# Altium schematic sheet Power_BE.SchDoc: PDN - Backend
size A4; Date: 06.10.2023; ApprovedBy: M.Sc. Tobias Wirth; CheckedBy: M.Sc. Tobias Wirth; Author: M.Sc. Tobias Wirth; CompanyName: University of Stuttgart; DrawnBy: M.Sc. Tobias Wirth; Engineer: M.Sc. Tobias Wirth; Organization: IIS; Address1: Pfaffenwaldring 47; Address2: 70569 Stuttgart; Revision: V1.2; SheetNumber: 16; SheetTotal: 17; ProjectNameAlt: AUS - NMR System; Time: 17:30; ImagePath: N/A; Application_BuildNumber: N/A
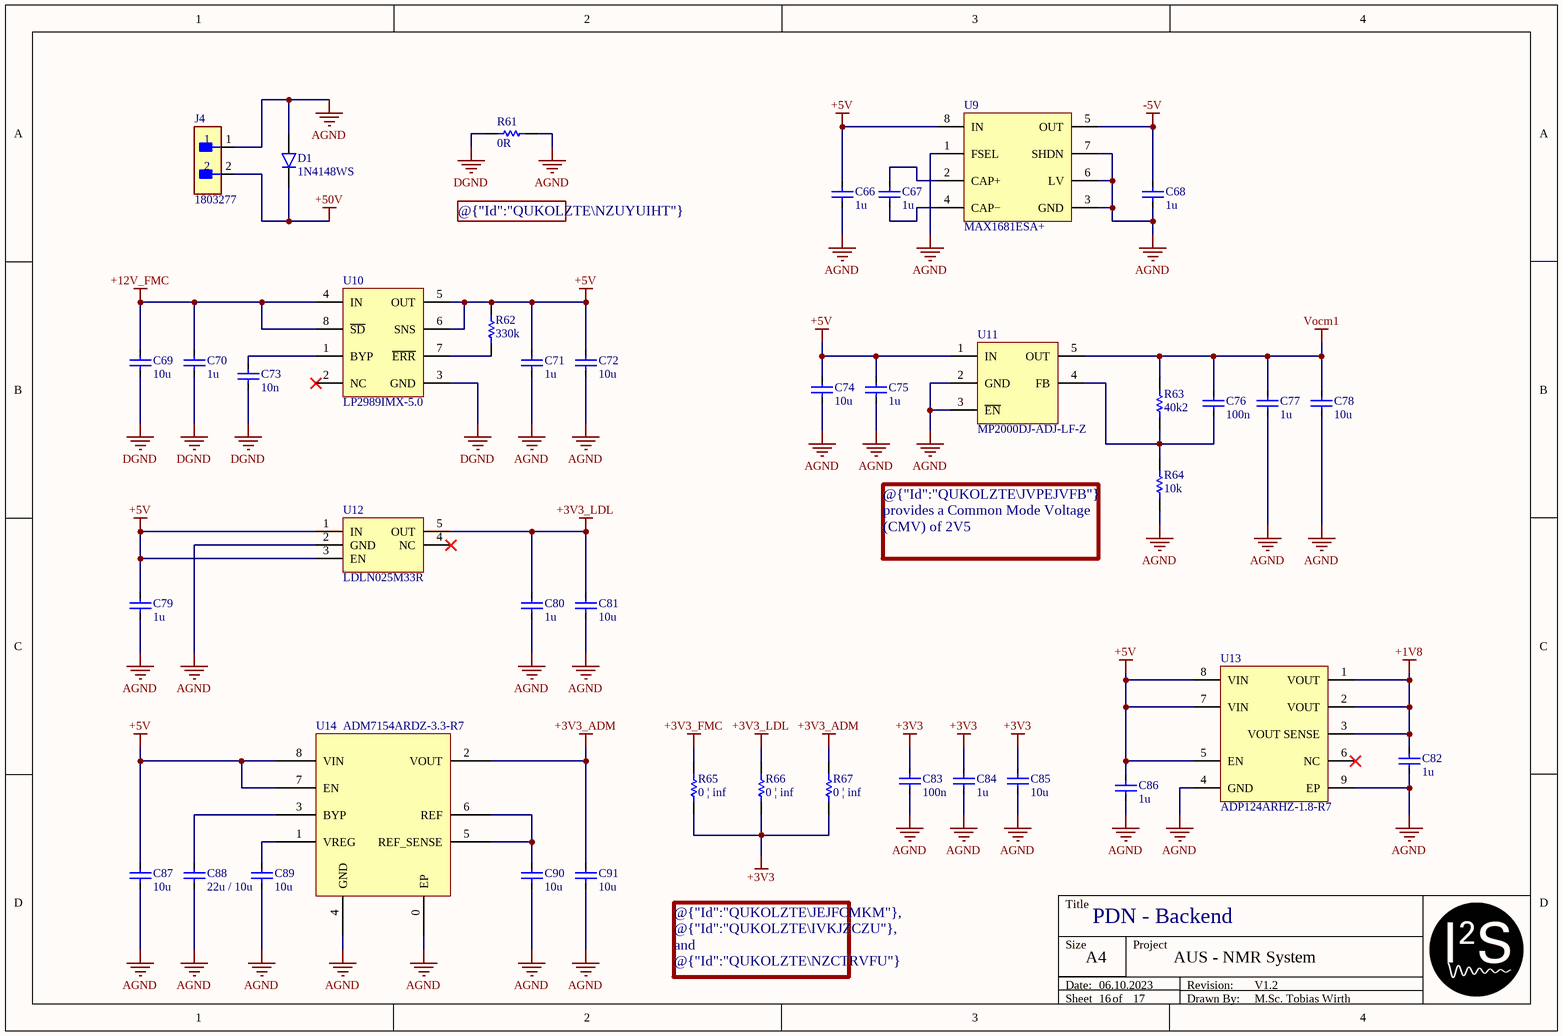
[diagram p0: Power_BE.SchDoc]

## Parts
C66  1u  [CAP_0402]
C67  1u  [CAP_0402]
C68  1u  [CAP_0402]
C69  10u  [CAP_0603]
C70  1u  [CAP_0402]
C71  1u  [CAP_0402]
C72  10u  [CAP_0603]
C73  10n  [CAP_0402]
C74  10u  [CAP_0603]
C75  1u  [CAP_0402]
C76  100n  [CAP_0402]
C77  1u  [CAP_0402]
C78  10u  [CAP_0603]
C79  1u  [CAP_0402]
C80  1u  [CAP_0402]
C81  10u  [CAP_0603]
C82  1u  [CAP_0402]
C83  100n  [CAP_0402]
C84  1u  [CAP_0402]
C85  10u  [CAP_0603]
C86  1u  [CAP_0402]
C87  10u  [CAP_0603]
C88  22u / 10u  [CAP_0603]
C89  10u  [CAP_0603]
C90  10u  [CAP_0603]
C91  10u  [CAP_0603]
D1  1N4148WS  [SOD-123F]
J4  1803277  [Phoenix_MC1,5/2-G-3,81]
R61  0R  [RES_0402]
R62  330k  [RES_0402]
R63  40k2  [RES_0402]
R64  10k  [RES_0402]
R65  0 | inf  [RES_0402]
R66  0 | inf  [RES_0402]
R67  0 | inf  [RES_0402]
U9  MAX1681ESA+  [SOP127P600X175-8N]
U10  LP2989IMX-5.0  [SOP127P600X175-8N]
U11  MP2000DJ-ADJ-LF-Z  [SOT95P280X145-5N]
U12  LDLN025M33R  [SOT95P280X145-5N]
U13  ADP124ARHZ-1.8-R7  [TSOP65P490X94_HS-9N - TW]
U14  ADM7154ARDZ-3.3-R7  [SOIC-8_TP - TW]

## Nets
+1V8: C82.1 U13.1(VOUT) U13.2(VOUT) U13.3(VOUT_SENSE)
+3V3: C83.1 C84.1 C85.1 R65.1 R66.1 R67.1
+3V3_ADM: C91.1 R67.2 U14.2(VOUT)
+3V3_FMC: R65.2
+3V3_LDL: C80.1 C81.1 R66.2 U12.5(OUT)
+5V: C66.1 C71.1 C72.1 C74.1 C75.1 C79.1 C86.1 C87.1 R62.2 U9.8(IN) U10.5(OUT) U10.6(SNS) U11.1(IN) U12.1(IN) U12.3(EN) U13.5(EN) U13.7(VIN) U13.8(VIN) U14.7(EN) U14.8(VIN)
+12V_FMC: C69.1 C70.1 U10.4(IN) U10.8(~{SD})
+50V: D1.2 J4.2
-5V: C68.1 U9.5(OUT)
AGND: C66.2 C68.2 C71.2 C72.2 C74.2 C75.2 C77.2 C78.2 C79.2 C80.2 C81.2 C82.2 C83.2 C84.2 C85.2 C86.2 C87.2 C88.2 C89.2 C90.2 C91.2 D1.1 J4.1 R61.2 R64.1 U9.1(FSEL) U9.3(GND) U9.6(LV) U9.7(SHDN) U11.2(GND) U11.3(~{EN}) U12.2(GND) U13.4(GND) U13.9(EP) U14.0(EP) U14.4(GND)
DGND: C69.2 C70.2 C73.2 R61.1 U10.3(GND)
Vocm1: C76.1 C77.1 C78.1 R63.2 U11.5(OUT)
NetC67_1: C67.1 U9.2(CAP+)
NetC67_2: C67.2 U9.4(CAP−)
NetC73_1: C73.1 U10.1(BYP)
NetC76_2: C76.2 R63.1 R64.2 U11.4(FB)
NetC88_1: C88.1 U14.3(BYP)
NetC89_1: C89.1 U14.1(VREG)
NetC90_1: C90.1 U14.5(REF_SENSE) U14.6(REF)
NetR62_1: R62.1 U10.7(~{ERR})

Not connected (* = marked no-connect by the designer): U10 2(NC)*; U12 4(NC)*; U13 6(NC)*

## Notes on the sheet
- @{"Id":"QUKOLZTE\NZUYUIHT"} is a net tie
- @{"Id":"QUKOLZTE\JVPEJVFB"} provides a Common Mode Voltage (CMV) of 2V5
  Vout = 0.5V x (1 + @{"Id":"QUKOLZTE\JVPEJVFB"} / @{"Id":"QUKOLZTE\AKRNTEXK"} )
- @{"Id":"QUKOLZTE\JEJFCMKM"}, @{"Id":"QUKOLZTE\IVKJZCZU"}, and @{"Id":"QUKOLZTE\NZCTRVFU"} are used to control the +3V3 VDD of the DAC and TRX protection circuit
- Title
- Size
- Date:
- Sheet
- A4
- of
- Project
- Drawn By:
- Revision:

## Library data of the parts
C66-C91 = Cap: Supplier: *; Part Number: *
  C66-C68 C70 C71 C75 C77 C79 C80 C82 C84 C86: Value: 1u
  C69 C72 C74 C78 C81 C85 C87 C89-C91: Value: 10u
  C73: Value: 10n
  C76 C83: Value: 100n
  C88: Value: 22u / 10u
D1 = Diode: Supplier 1: Future Electronics; Supplier Part Number 1: 8814485
J4 = Phoenix_MC1,5/2-G-3,81: Manufacturer: Phoenix Contact; Manufacturer P/N: 1803277; Manufacturer Name: MC 1,5/ 2-G-3,81; Supplier 1: Arrow Electronics; Supplier Part Number 1: 1803277
R61 = Res: Net tie; Part Number: *; Supplier: *; Value: 0R
R62-R67 = Res: Part Number: *; Supplier: *
  R62: Value: 330k
  R63: Value: 40k2
  R64: Value: 10k
  R65-R67: Value: 0 | inf
U9 = MAX1681: 125mA, Frequency-Selectable, Switched-Capacitor Voltage Converters; Supplier 1: Mouser; Supplier Part Number 1: 700-MAX1681ESA
U10 = LP2989: Supplier 1: Heisener; Supplier Part Number 1: LP2989IMX-5.0
U11 = MP2000: Supplier 1: Digi-Key; Supplier Part Number 1: 1589-1865-1-ND
U12 = LDLN025: Supplier 1: Mouser; Supplier Part Number 1: 511-LDLN025M33R
U13 = ADP124: Supplier 1: Mouser; Supplier Part Number 1: 584-ADP124ARHZ-1.8R7
U14 = ADM715X: Supplier 1: Mouser; Supplier Part Number 1: 584-ADM7154ARDZ3.3R7